# EAGLE board Large ground pour test (EAGLE 8.7.0)
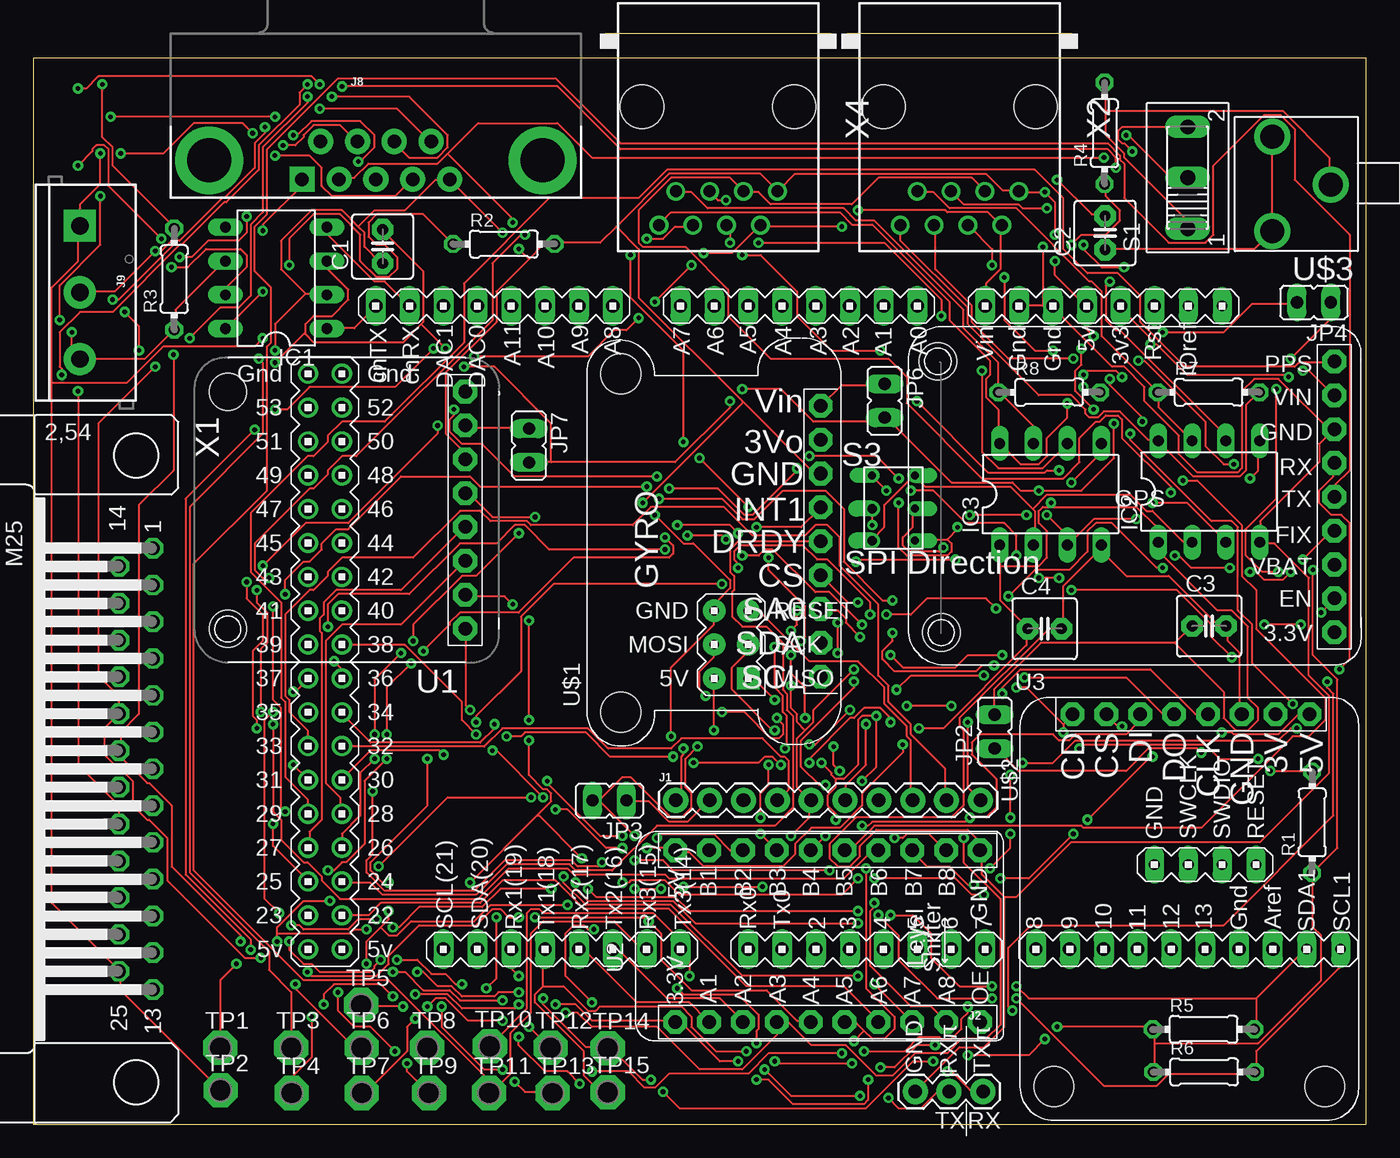
[diagram p1: board, top side]
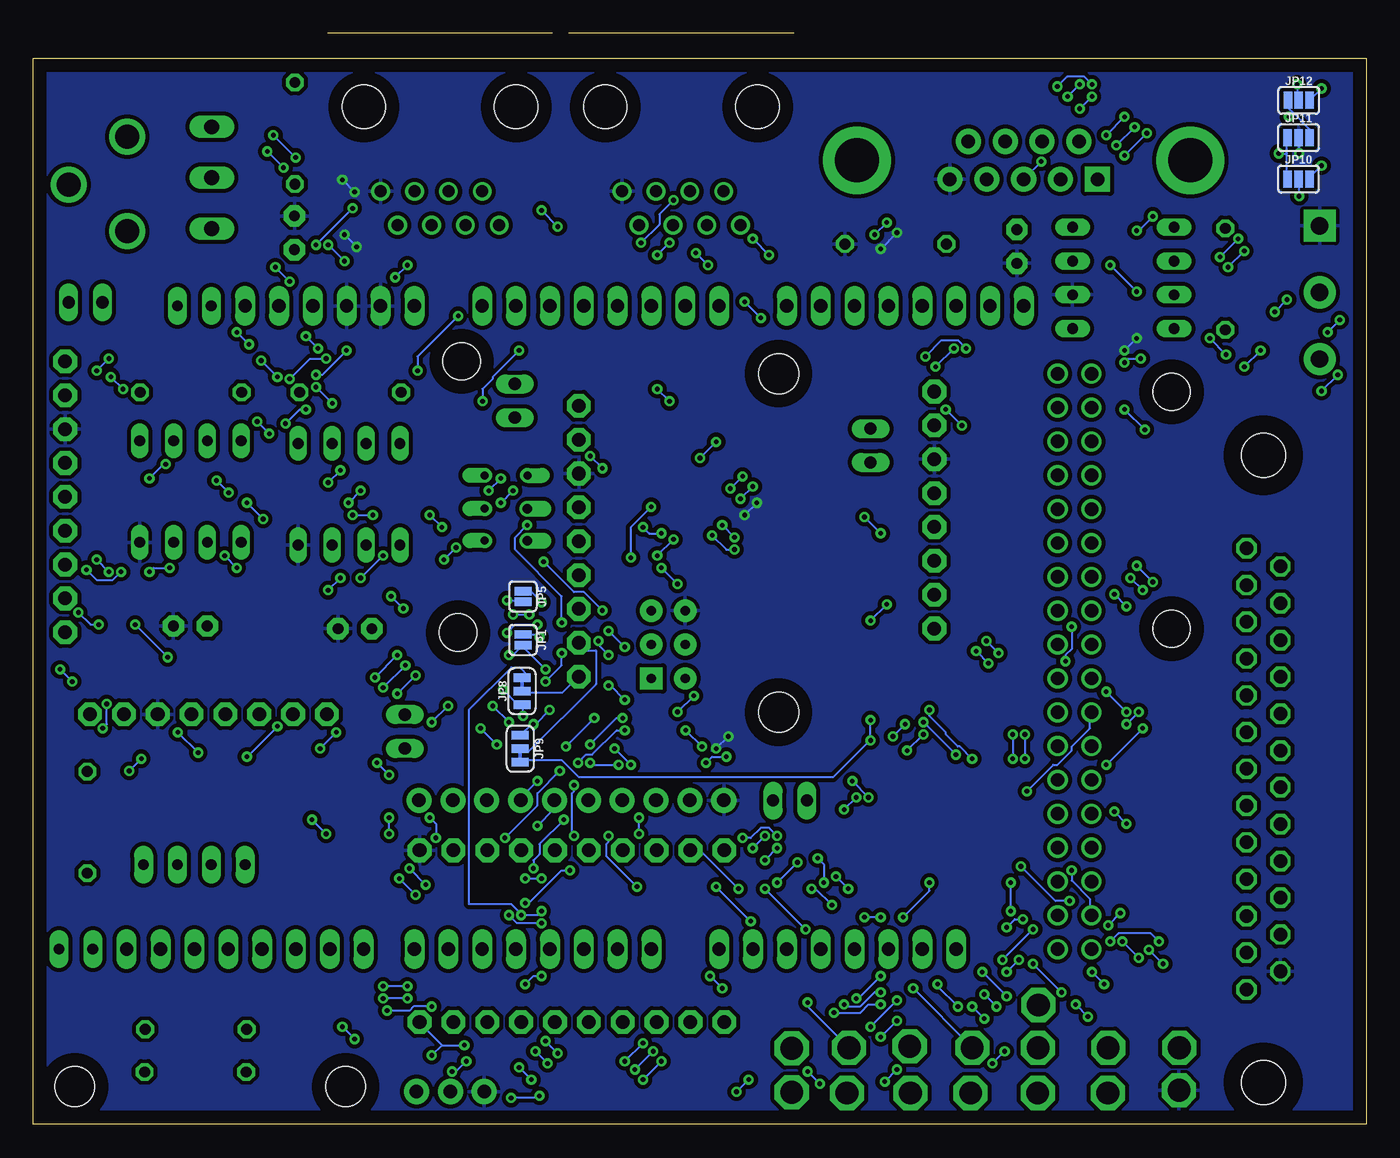
[diagram p2: board, bottom side, seen from below]

Size 100 x 80 mm. Coordinates in mm from the lower left corner, seen from the top.
Outline: 0,0 100,0 100,80 0,80 0,0
Copper layers (1*16): Top 0.035mm / dielectric 1.5mm / Bottom 0.035mm
Design rules "default": minimum track width 6mil, minimum drill 0.35mm, track to track 6mil, track to pad 6mil, pad to pad 6mil, via to via 6mil, smd to smd 6mil, copper to edge 40mil, drill to drill 6mil, minimum pad ring 10mil, minimum via ring 8mil, stop-mask expansion 4mil, vias tented up to drill 0mil, thermal gap 10mil
Net classes: 1 Power: width 0.508 mm, drill 0.305 mm, clearance 0.254 mm

## Footprints (pad centres in the part's own frame; a part is rotated, then mirrored left to right if it is on the bottom)
C2.5-5 = drill 0.813 pad 1.6 octagon: 1 -1.27,0; 2 1.27,0
DIL08 = drill 0.813 long: 1 -3.81,-3.81; 2 -1.27,-3.81; 3 1.27,-3.81; 4 3.81,-3.81; 5 3.81,3.81; 6 1.27,3.81; 7 -1.27,3.81; 8 -3.81,3.81
1X10 = drill 1.016 pad 1.88: 1 0,0; 2 2.54,0; 3 5.08,0; 4 7.62,0; 5 10.16,0; 6 12.7,0; 7 15.24,0; 8 17.78,0; 9 20.32,0; 10 22.86,0
1X03 = drill 1.016 pad 1.88: 1 2.54,0; 2 0,0; 3 -2.54,0
DB9_MALE = drill 1.016 pad 1.88: 1 5.54,-1.42; 2 2.77,-1.42; 3 0,-1.42; 4 -2.77,-1.42; 6 4.15,1.42; 7 1.38,1.42; 8 -1.38,1.42; 9 -4.15,1.42 | drill 1.016 pad 1.88 square: 5 -5.54,-1.42 | drill 3.302 pad 5.08: G1 -12.5,0; G2 12.5,0
SCREWTERMINAL-5MM-3 = drill 1.3 pad 2.413 square: 1 0,0 | drill 1.3 pad 2.413: 2 5,0; 3 10,0
SMT-JUMPER_2_NO_SILK = smd 0.635 x 1.27: 1 -0.406,0; 2 0.406,0
JP1 = drill 0.914 long: 1 0,-1.27; 2 0,1.27
SMT-JUMPER_3_1-NC_TRACE_SILK = smd 0.635 x 1.27: 1 -1.016,0; 2 0,0; 3 1.016,0
SMT-JUMPER_3_NO_SILK = smd 0.635 x 1.27: 1 -0.813,0; 2 0,0; 3 0.813,0
DUE(NORMAL) = drill 1 long: 2 -16.51,30.48; 3 -19.05,30.48; 3V3 -39.37,-17.78; 4 -21.59,30.48; 5 -24.13,30.48; 5V -36.83,-17.78; 6 -26.67,30.48; 7 -29.21,30.48; 8 -33.02,30.48; 9 -35.56,30.48; 10 -38.1,30.48; 11 -40.64,30.48; 12 -43.18,30.48; 13 -45.72,30.48; A0 -24.13,-17.78; A1 -21.59,-17.78; A2 -19.05,-17.78; A3 -16.51,-17.78; A4 -13.97,-17.78; A5 -11.43,-17.78; A6 -8.89,-17.78; A7 -6.35,-17.78; A8 -1.27,-17.78; A9 1.27,-17.78; A10 3.81,-17.78; A11 6.35,-17.78; AREF -50.8,30.48; CANRX 13.97,-17.78; CANTX 16.51,-17.78; DAC0 8.89,-17.78; DAC1 11.43,-17.78; GND1 -48.26,30.48; GND_1 -34.29,-17.78; GND_2 -31.75,-17.78; RESET -41.91,-17.78; RX0 -11.43,30.48; RX1 6.35,30.48; RX2 1.27,30.48; RX3 -3.81,30.48; SCL 11.43,30.48; SDA 8.89,30.48; TX0 -13.97,30.48; TX1 3.81,30.48; TX2 -1.27,30.48; TX3 -6.35,30.48; VIN -29.21,-17.78 | drill 1: 5V_A 19.05,30.48; 5V_B 21.59,30.48; 22 19.05,27.94; 23 21.59,27.94; 24 19.05,25.4; 25 21.59,25.4; 26 19.05,22.86; 27 21.59,22.86; 28 19.05,20.32; 29 21.59,20.32; 30 19.05,17.78; 31 21.59,17.78; 32 19.05,15.24; 33 21.59,15.24; 34 19.05,12.7; 35 21.59,12.7; 36 19.05,10.16; 37 21.59,10.16; 38 19.05,7.62; 39 21.59,7.62; 40 19.05,5.08; 41 21.59,5.08; 42 19.05,2.54; 43 21.59,2.54; 44 19.05,0; 45 21.59,0; 46 19.05,-2.54; 47 21.59,-2.54; 48 19.05,-5.08; 49 21.59,-5.08; 50 19.05,-7.62; 51 21.59,-7.62; 52 19.05,-10.16; 53 21.59,-10.16; GND_A 19.05,-12.7; GND_B 21.59,-12.7 | drill 0.7 pad 1.676: 5V_ICSP -8.89,5.08; GND_ICSP -8.89,10.16; MOSI_ICSP -8.89,7.62; RESET_ICSP -11.43,5.08; SCK_ICSP -11.43,7.62 | drill 0.8 pad 1.422 long: GND_DEBUG -41.91,24.13; IOREF -44.45,-17.78; NC -46.99,-17.78; RESET_DEBUG -49.53,24.13; SCL1 -55.88,30.48; SDA1 -53.34,30.48; SWCLK_DEBUG -44.45,24.13; SWDIO_DEBUG -46.99,24.13 | drill 0.7 pad 1.676 square: MISO_ICSP -11.43,10.16
0204/7 = drill 0.813 octagon: 1 -3.81,0; 2 3.81,0
255SB = drill 1.118 long: 1 -3.81,0; 2 0,0; 3 3.81,0
DPDT = drill 0.6 offset: 1 3.2,4.9; 2 3.2,2.4; 3 3.2,0; 4 0,4.9 | drill 0.7 offset: 5 0,2.4; 6 0,0
P1-17 = drill 1.702 pad 2.54 octagon: TP 0,0
ELCOMPASS = drill 1.016 pad 1.778 octagon: 1 1.27,1.27; 2 1.27,3.81; 3 1.27,6.35; 4 1.27,8.89; 5 1.27,11.43; 6 1.27,13.97; 7 1.27,16.51; 8 1.27,19.05 | hole 2.8: 19.066,19.07; 19.066,1.29
ELSHIFTER = drill 1.016 pad 1.778 octagon: 1 0,11.43; 2 0,8.89; 3 0,6.35; 4 0,3.81; 5 0,1.27; 6 0,-1.27; 7 0,-3.81; 8 0,-6.35; 9 0,-8.89; 10 0,-11.43; 11 12.89,11.43; 12 12.89,8.89; 13 12.89,6.35; 14 12.89,3.81; 15 12.89,1.27; 16 12.89,-1.27; 17 12.89,-3.81; 18 12.89,-6.35; 19 12.89,-8.89; 20 12.89,-11.43
ELGPS = drill 1.016 pad 1.778 octagon: 1 0,-10.16; 2 0,-7.62; 3 0,-5.08; 4 0,-2.54; 5 0,0; 6 0,2.54; 7 0,5.08; 8 0,7.62; 9 0,10.16 | hole 2.8: 29.48,10.18; 29.74,-10.18
ELGYRO = drill 1.016 pad 1.778 octagon: 1 21.59,2.54; 2 19.05,2.54; 3 16.51,2.54; 4 13.97,2.54; 5 11.43,2.54; 6 8.89,2.54; 7 6.35,2.54; 8 3.81,2.54; 9 1.27,2.54 | hole 3: -1.397,17.526; 24.003,17.526
ELSDCARD = drill 1.016 pad 1.778 octagon: 1 1.27,1.27; 2 1.27,3.81; 3 1.27,6.35; 4 1.27,8.89; 5 1.27,11.43; 6 1.27,13.97; 7 1.27,16.51; 8 1.27,19.05 | hole 3: -26.67,0.127; -26.67,20.447
2.5MMJACK = drill 1.8: 1 2,5.1; 2 6.4,1.5; 3 6.4,8.6
M25H = drill 1.016 octagon: 1 -16.561,1.27; 2 -13.792,1.27; 3 -11.049,1.27; 4 -8.28,1.27; 5 -5.512,1.27; 6 -2.769,1.27; 7 0,1.27; 8 2.769,1.27; 9 5.512,1.27; 10 8.28,1.27; 11 11.049,1.27; 12 13.792,1.27; 13 16.561,1.27; 14 -15.189,-1.27; 15 -12.421,-1.27; 16 -9.652,-1.27; 17 -6.909,-1.27; 18 -4.14,-1.27; 19 -1.372,-1.27; 20 1.372,-1.27; 21 4.14,-1.27; 22 6.909,-1.27; 23 9.652,-1.27; 24 12.421,-1.27; 25 15.189,-1.27 | hole 3.302: 23.52,0; -23.52,0
RJ45-NO-SHIELD = drill 0.9 pad 1.4: 1 -4.445,6.35; 2 -3.175,8.89; 3 -1.905,6.35; 4 -0.635,8.89; 5 0.635,6.35; 6 1.905,8.89; 7 3.175,6.35; 8 4.445,8.89 | hole 3.251: -5.715,0; 5.715,0

## Placement (x,y rotation side)
C1  0.1 uF  [C2.5-5]  26.21,65.87 90 top
C2  1 uF  [C2.5-5]  80.41,66.89 90 top
C3  0.1 uF  [C2.5-5]  88.22,37.39 0 top
C4  0.1 uF  [C2.5-5]  75.87,37.19 0 top
IC1  MCP2551  [DIL08]  18.22,63.51 90 top
IC2  DS8921  [DIL08]  88.21,47.48 0 top
IC3  DS8921  [DIL08]  76.31,47.28 0 top
J1  Optical Mouse  [1X10]  48.2,24.32 0 top
J2  RaspπUart  [1X03]  68.71,2.46 0 top
J8  DB9 Plug  [DB9_MALE]  25.7,72.33 0 top
J9  CAN Output  [SCREWTERMINAL-5MM-3]  3.49,67.42 270 top
JP1  [SMT-JUMPER_2_NO_SILK]  63.27,36.35 270 bottom
JP2  MicroSD Power  [JP1]  72.12,29.47 0 top
JP3  Mouse Power  [JP1]  43.23,24.3 90 top
JP4  GPS Power  [JP1]  96.08,61.67 90 top
JP5  [SMT-JUMPER_2_NO_SILK]  63.27,39.61 270 bottom
JP6  Gyro Power  [JP1]  63.88,54.29 180 top
JP7  Compass Power  [JP1]  37.19,50.93 180 top
JP8  [SMT-JUMPER_3_1-NC_TRACE_SILK]  63.33,32.5 90 bottom
JP9  [SMT-JUMPER_3_1-NC_TRACE_SILK]  63.47,28.19 270 bottom
JP10  [SMT-JUMPER_3_NO_SILK]  5.08,70.93 0 bottom
JP11  [SMT-JUMPER_3_NO_SILK]  5.07,74.03 0 bottom
JP12  [SMT-JUMPER_3_NO_SILK]  5.06,76.83 0 bottom
MCU2  DUE(NORMAL)  [DUE(NORMAL)]  42.2,43.62 180 top
R1  4.7 k  [0204/7]  95.95,22.66 90 top
R2  10 k  [0204/7]  35.3,66.05 0 top
R3  120  [0204/7]  10.57,63.42 90 top
R4  4.7 k  [0204/7]  80.37,74.36 90 top
R5  4.7 k  [0204/7]  87.8,7.13 0 top
R6  4.7 k  [0204/7]  87.84,3.93 0 top
R7  100  [0204/7]  88.18,54.93 0 top
R8  100  [0204/7]  76.22,54.93 0 top
S1  Click Source  [255SB]  86.61,71.03 90 top
S3  SPI Direction  [DPDT]  62.93,43.79 0 top
TP1  TPPAD1-17  [P1-17]  14.02,5.75 0 top
TP2  TPPAD1-17  [P1-17]  14.04,2.55 0 top
TP3  TPPAD1-17  [P1-17]  19.36,5.75 0 top
TP4  TPPAD1-17  [P1-17]  19.38,2.35 0 top
TP5  TPPAD1-17  [P1-17]  24.6,8.95 0 top
TP6  TPPAD1-17  [P1-17]  24.62,5.75 0 top
TP7  TPPAD1-17  [P1-17]  24.64,2.35 0 top
TP8  TPPAD1-17  [P1-17]  29.56,5.75 0 top
TP9  TPPAD1-17  [P1-17]  29.68,2.35 0 top
TP10  TPPAD1-17  [P1-17]  34.25,5.85 0 top
TP11  TPPAD1-17  [P1-17]  34.2,2.35 0 top
TP12  TPPAD1-17  [P1-17]  38.8,5.75 0 top
TP13  TPPAD1-17  [P1-17]  38.95,2.35 0 top
TP14  TPPAD1-17  [P1-17]  43.1,5.7 0 top
TP15  TPPAD1-17  [P1-17]  43.1,2.4 0 top
U1  COMPASS  [ELCOMPASS]  33.67,56.25 180 top
U2  LLSHIFTER  [ELSHIFTER]  59.59,7.67 90 top
U3  GPS  [ELGPS]  97.61,47.08 180 top
U$1  Gyro  [ELGYRO]  61.61,32.32 90 top
U$2  Micro-SD  [ELSDCARD]  97.02,29.5 90 top
U$3  [2.5MMJACK]  99.36,75.6 180 top
X1  Vehicle control  [M25H]  7.71,26.67 270 top
X2  RJ45-8L-B  [RJ45-NO-SHIELD]  69.49,76.35 180 top
X4  RJ45-8L-B  [RJ45-NO-SHIELD]  51.38,76.35 180 top

## Tracks (layer width: path | path; a pad name or v marks a point on that pad's centre or on a via)
+3V3  (via drill 0.35)
  Top 0.152: v52.88,4.72 51.51,4.72 48.62,7.62 48.31,7.62 U2.1 48.16,7.77 41.91,7.77 40.69,8.99 v39.17,8.99 | v54.25,3.35 55.17,3.35 57,1.52 62.33,1.52 62.64,1.83 v62.64,3.35 | v63.55,4.27 64.62,4.27 66.29,5.94 v67.67,5.94 | v20.88,8.08 20.88,5.03 19.51,3.66 19.51,2.44 TP4.TP | v21.79,8.99 21.79,9.75 22.55,10.52 26.06,10.52 v26.98,9.6 | v28.8,11.43 29.26,11.43 30.33,10.36 31.39,10.36 32.16,9.6 34.59,9.6 34.9,9.91 v36.42,9.91 | v84.73,59.44 89.31,59.44 91.44,61.57 94.79,61.57 JP4.2 | MCU2.3V3 81.53,61.27 83.82,58.98 v83.82,58.52 84.28,58.52 86.56,56.24 94.03,56.24 v94.18,56.08 | 84.12,6.1 84.12,7.01 R5.1 83.97,7.16 83.82,7.32 v76.81,7.32 | 84.12,6.1 84.12,3.96 R6.1 | 84.12,6.1 91.9,6.1 96.62,10.82 96.62,14.17 96.01,14.78 96.01,18.75 R1.1 96.01,18.9 97.84,20.73 97.84,33.38 96.01,35.2 v96.01,41.6 | v93.27,55.17 93.27,46.94 90.98,44.65 90.98,42.67 92.2,41.45 v93.42,41.45 | v70.1,5.18 74.68,5.18 v75.89,6.4
  Bottom 0.152: v54.25,3.35 v52.88,4.72 | v63.55,4.27 v62.64,3.35 | 69.34,5.94 v67.67,5.94 | 69.34,5.94 71.02,7.62 U2.10 | v21.79,8.99 v20.88,8.08 | v28.8,11.43 v26.98,9.6 | v36.42,9.91 36.88,9.91 37.95,8.84 39.01,8.84 v39.17,8.99 | v83.82,58.52 v84.73,59.44 | v93.27,55.17 v94.18,56.08 | v93.42,41.45 94.03,40.84 95.25,40.84 v96.01,41.6 | v70.1,5.18 69.34,5.94 | v76.81,7.32 v75.89,6.4
+5V  (via drill 0.35)
  Top 0.152: 20.42,59.44 20.42,59.28 21.03,58.67 27.74,58.67 29.11,60.05 | 20.42,59.44 20.42,60.05 21.03,60.66 22.4,60.66 23.62,61.87 23.62,62.64 22.1,64.16 22.1,64.77 IC1.3 | 29.11,60.05 29.26,60.2 29.26,64.01 26.21,67.06 C1.2 | v16.92,57.45 17.22,57.15 17.22,51.82 11.73,46.33 11.73,18.9 17.68,12.95 17.68,11.58 19.36,9.91 19.36,5.79 TP3.TP | 20.42,59.44 v18.14,57.15 | v77.88,65.99 78.64,66.75 80.47,66.75 81.53,67.82 81.53,68.58 80.47,69.65 80.47,70.41 R4.1 | v76.66,64.77 76.66,63.7 78.94,61.42 MCU2.5V 79.1,61.27 79.1,59.59 v79.55,59.13 | 38.86,49.68 48.16,49.68 52.27,53.8 v52.27,54.25 | 38.86,49.68 37.34,49.68 JP7.2 | v53.19,55.17 56.08,55.17 58.52,52.73 63.7,52.73 63.86,52.88 JP6.2 64.01,53.03 68.89,48.16 73.46,48.16 74.07,47.55 v75.44,47.55 78.64,47.55 81.08,49.99 v81.08,52.58 | v78.64,58.22 78.64,57 78.18,56.54 78.18,55.02 v79.55,53.65 | 42.37,24.23 42.52,24.23 v45.11,21.64 | 42.37,24.23 42.06,24.23 JP3.2 42.37,24.23 | v46.02,20.73 48.01,20.73 48.16,20.57 U2.11 48.31,20.42 49.23,20.42 50.29,19.36 56.24,19.36 57.15,20.27 57.15,21.03 58.37,22.25 60.5,22.25 62.18,23.93 62.18,24.84 65.23,27.89 v65.23,28.5 | v51.05,29.57 51.05,33.38 MCU2.GND_ICSP | v49.84,28.35 48.92,27.43 48.92,25.3 49.38,24.84 49.38,23.77 48.62,23.01 47.85,23.01 44.81,26.06 44.2,26.06 42.37,24.23 | 72.54,41.91 72.54,39.32 74.52,37.34 C4.1 74.52,37.19 74.52,35.97 68.28,29.72 v66.45,29.72 | 72.54,41.91 72.54,43.43 IC3.1 | 76.35,46.33 75.74,46.33 75.44,46.02 75.44,45.11 76.05,44.5 76.05,42.52 75.44,41.91 72.54,41.91 | 76.35,46.33 82.75,46.33 84.28,44.81 84.28,43.74 IC2.1 84.43,43.59 84.43,42.98 88.85,38.56 89.92,38.56 91.14,37.34 91.14,32 91.9,31.24 91.9,30.33 91.14,29.57 90.22,29.57 89.31,30.48 89.31,32.46 85.65,36.12
  Top 0.152: 85.65,36.12 75.59,36.12 72.08,32.61 72.08,30.79 JP2.2 | 85.65,36.12 86.87,37.34 C3.1 | 76.35,46.33 v76.35,46.63 | v30.94,58.22 29.11,60.05 | v32.31,56.84 34.59,56.84 38.86,52.58 38.86,49.68
  Bottom 0.152: v16.92,57.45 17.83,57.45 v18.14,57.15 | v76.66,64.77 v77.88,65.99 | v53.19,55.17 v52.27,54.25 | v78.64,58.22 v79.55,59.13 | v79.55,53.65 80.01,53.65 v81.08,52.58 | v46.02,20.73 v45.11,21.64 | v49.84,28.35 v51.05,29.57 | v66.45,29.72 v65.23,28.5 | v76.35,46.63 v75.44,47.55 | v32.31,56.84 v30.94,58.22
C2_RX  (via drill 0.35)
  Top 0.152: v9.14,56.84 4.88,52.58 4.88,33.68 6.4,32.16 6.4,30.94 X1.18 6.4,30.79 5.33,29.72 5.33,27.74 6.1,26.98 6.25,26.98 7.47,25.76 7.47,23.93 8.53,22.86 8.69,22.86 10.06,21.49 10.06,18.29 15.85,12.5 v17.07,12.5 | v7.92,58.06 7.92,59.89 v6.86,60.96 | v5.94,61.87 6.4,61.87 10.82,66.29 10.97,66.29 14.17,69.49 14.33,69.49 16.61,71.78 16.61,73.61 17.37,74.37 v17.37,74.83 | v18.75,73.46 19.66,73.46 20.27,74.07 20.27,74.22 21.03,74.98 23.01,74.98 24.23,73.76 J8.8 | v46.79,21.49 47.09,21.79 51.05,21.79 52.27,20.57 53.19,20.57 U2.13 | v44.2,21.64 42.52,21.64 38.56,25.6 v38.56,25.76 | v37.34,24.54 31.09,24.54 v25.91,19.36 | v22.25,16.76 20.27,16.76 18.29,14.78 18.29,14.33 | v18.29,13.72 18.29,14.33 | v36.12,3.2 36.88,2.44 38.86,2.44 TP13.TP | v35.2,4.12 33.83,4.12 30.63,7.32 v30.63,8.84 | v32.16,10.52 31.7,10.52 30.94,11.28 29.87,11.28 28.8,12.34 v27.28,12.34 | v24.99,14.63 24.08,14.63 23.77,14.33 18.29,14.33
  Bottom 0.152: v7.92,58.06 v9.14,56.84 | v5.94,61.87 v6.86,60.96 | v18.75,73.46 v17.37,74.83 | v46.79,21.49 46.18,21.49 45.41,22.25 44.81,22.25 v44.2,21.64 | v37.34,24.54 v38.56,25.76 | v25.91,19.36 23.32,16.76 v22.25,16.76 | v17.07,12.5 v18.29,13.72 | v35.2,4.12 v36.12,3.2 | v30.63,8.84 32.16,10.36 v32.16,10.52 | v24.99,14.63 v27.28,12.34
C2_TX  (via drill 0.35)
  Top 0.152: v45.11,17.68 v47.09,17.68 | v42.06,14.63 41.6,14.63 41.3,14.94 40.54,14.94 39.93,14.33 39.93,11.12 v41.91,9.14 | 6.55,28.04 6.55,29.41 7.92,30.79 7.92,46.48 10.52,49.07 v10.52,57.76 | v11.73,58.98 14.02,61.27 15.39,61.27 16.31,62.18 16.31,67.51 17.22,68.43 17.22,73.3 20.57,76.66 v20.57,77.11 | v21.49,76.2 27.28,76.2 29.72,73.76 J8.6 | v37.19,7.32 38.71,5.79 TP12.TP | v35.2,9.3 32,9.3 31.24,10.06 29.26,10.06 27.89,11.43 v26.98,11.43 | v26.06,12.34 25.6,11.89 25.6,11.73 25.3,11.43 21.49,11.43 20.88,12.04 20.27,12.04 19.2,13.11 v19.2,13.72 | v15.54,13.72 15.54,14.17 10.36,19.36 10.36,23.93 8.69,25.6 8.53,25.6 6.55,27.58 6.55,28.04 | 6.55,28.04 X1.19
  Bottom 0.152: v47.09,17.68 49.84,20.42 50.6,20.42 U2.12 | v42.06,14.63 v45.11,17.68 | v41.91,9.14 41.91,8.84 38.86,5.79 TP12.TP | v11.73,58.98 v10.52,57.76 | v21.49,76.2 v20.57,77.11 | v35.2,9.3 v37.19,7.32 | v26.06,12.34 v26.98,11.43 | v19.2,13.72 18.59,14.33 16.15,14.33 v15.54,13.72
CANH  (via drill 0.35)
  Top 0.152: v5.18,78.03 5.18,74.07 5.94,73.3 5.94,71.93 10.52,67.36 R3.2 10.52,67.21 10.52,66.45 9.6,65.53 v9.14,65.53 6.1,62.48 3.5,62.48 J9.2 | v10.36,64.31 11.58,64.31 12.95,65.68 15.54,65.68 16,65.23 16,64.31 14.48,62.79 14.48,62.33 IC1.7
  Bottom 0.152: v5.18,78.03 5.18,76.96 JP12.2 | v9.14,65.53 v10.36,64.31
CANL  (via drill 0.35)
  Top 0.152: IC1.6 14.33,64.77 10.67,61.11 10.67,59.74 R3.1 10.52,59.59 8.38,57.45 3.5,57.45 J9.3 3.35,57.45 2.9,57.91 v2.9,59.44 | v5.03,69.65 5.03,65.99 1.98,62.94 v1.98,60.35
  Bottom 0.152: v5.03,69.65 5.03,70.87 JP10.2 | v2.9,59.44 v1.98,60.35
CANRX
  Top 0.152: IC1.4 22.1,67.21 22.1,66.75 25.6,63.25 26.36,63.25 28.19,61.42 MCU2.CANRX
CANTX
  Top 0.152: IC1.1 22.1,59.74 24.08,59.74 25.6,61.27 MCU2.CANTX
CARD_DETECT  (via drill 0.35)
  Top 0.152: v92.81,26.52 95.86,26.52 R1.2 | v91.9,27.43 89,27.43 87.94,28.5 78.79,28.5 v78.49,28.19 | 77.27,30.02 v77.27,29.41 | 77.27,30.02 77.88,30.63 U$2.8 | v22.55,34.75 23.01,34.29 23.01,33.53 MCU2.36 | v22.1,37.34 22.1,39.01 22.86,39.78 28.19,39.78 32,43.59 34.75,43.59 36.12,44.96 36.88,44.96 38.71,43.13 v47.4,43.13 | v49.07,44.2 51.66,44.2 v51.97,43.89 | v53.19,42.67 54.41,42.67 54.86,43.13 55.47,43.13 58.67,39.93 59.74,39.93 v62.18,37.49 | v64.47,36.88 64.47,36.27 63.7,35.51 63.7,34.9 64.62,33.98 70.71,33.98 71.17,34.44 v72.08,34.44 | v73.76,32.77 74.52,32.77 77.27,30.02
  Bottom 0.152: v91.9,27.43 v92.81,26.52 | v77.27,29.41 v78.49,28.19 | v22.55,34.75 22.55,35.2 22.1,35.66 v22.1,37.34 | v47.4,43.13 48.01,43.13 v49.07,44.2 | v53.19,42.67 v51.97,43.89 | v62.18,37.49 63.86,37.49 v64.47,36.88 | v73.76,32.77 v72.08,34.44
CLICK  (via drill 0.35)
  Top 0.152: v81.99,74.22 82.14,74.22 85.19,71.17 86.56,71.17 S1.2 | v80.31,72.54 41.91,72.54 39.32,75.13 33.38,75.13 31.09,72.85 | 31.09,72.85 30.33,72.08 25.15,72.08 24.08,71.02 23.01,71.02 J8.4 | v17.98,30.02 17.98,23.47 18.59,22.86 18.59,21.34 20.27,19.66 20.57,19.66 21.64,18.59 21.64,18.29 23.01,16.92 33.38,16.92 35.66,19.2 40.08,19.2 40.54,18.75 47.4,18.75 47.7,18.44 60.81,18.44 62.79,20.42 63.4,20.42 U2.17 | v17.07,30.94 17.07,35.66 17.53,36.12 17.53,38.41 16.76,39.17 v16.76,40.08 | v17.68,41 17.22,41 16.61,41.6 16.61,43.59 20.73,47.7 21.03,47.7 22.1,48.77 22.1,49.07 23.16,50.14 24.23,50.14 34.44,60.35 34.44,64.62 36.58,66.75 v36.88,66.75 | v35.97,67.67 35.97,67.97 31.09,72.85
  Bottom 0.152: v80.31,72.54 v81.99,74.22 | v17.07,30.94 v17.98,30.02 | v17.68,41 v16.76,40.08 | v35.97,67.67 v36.88,66.75
CS_C5_FRONT  (via drill 0.35)
  Top 0.152: v19.51,32.46 19.66,32.46 20.57,33.38 MCU2.37 | v17.98,30.94 17.37,30.33 17.37,16.92 v18.44,15.85 | v19.36,14.94 19.96,14.94 20.27,14.63 23.62,14.63 24.38,15.39 v25.76,15.39 | v26.98,14.78 27.43,14.78 28.96,16.31 33.68,16.31 35.05,17.68 v38.86,17.68 | v39.78,18.59 39.78,18.14 41.45,16.46 47.85,16.46 53.19,11.12 v61.87,11.12 | v63.09,10.52 65.84,7.77 U2.8
  Bottom 0.152: v17.98,30.94 v19.51,32.46 | v19.36,14.94 v18.44,15.85 | v25.76,15.39 26.36,15.39 v26.98,14.78 | v39.78,18.59 v38.86,17.68 | v61.87,11.12 62.48,11.12 v63.09,10.52
CS_C5_FRONT_5V  (via drill 0.35)
  Top 0.152: v78.03,57.45 73.15,57.45 70.41,60.2 70.41,61.42 67.67,64.16 67.67,67.36 X2.6 | v80.77,55.93 80.77,55.47 83.21,53.03 v83.21,52.73 | v82.3,51.82 82.3,51.36 88.39,45.26 89.92,45.26 90.37,44.81 90.37,38.56 91.44,37.49 91.44,34.59 v94.49,31.55 | v94.79,29.72 94.34,29.72 93.42,28.8 78.18,28.8 76.5,27.13 v74.22,27.13 | v73.3,23.01 v73.3,26.21 | v73.3,21.79 73.3,20.73 v71.78,19.2 | v70.56,17.98 70.1,17.98 68.73,19.36 67.06,19.36 65.99,20.42 U2.18
  Bottom 0.152: v78.03,57.45 79.25,57.45 v80.77,55.93 | v82.3,51.82 v83.21,52.73 | v94.49,31.55 94.49,30.02 v94.79,29.72 | v73.3,26.21 v74.22,27.13 | v73.3,21.79 v73.3,23.01 | v70.56,17.98 v71.78,19.2
CS_C5_REAR  (via drill 0.35)
  Top 0.152: v33.22,29.26 32.16,30.33 32.16,31.7 27.89,35.97 23.16,35.97 MCU2.38 | v34.44,28.04 34.75,28.04 v38.25,24.54 | v39.17,23.62 40.08,23.62 42.98,20.73 v44.2,20.73 | v45.11,19.81 47.24,19.81 48.01,19.05 v59.74,19.05 | v63.09,16.61 63.09,16.31 62.79,16 62.79,11.89 65.84,8.84 67.36,8.84 68.43,7.77 U2.9
  Bottom 0.152: v34.44,28.04 v33.22,29.26 | v39.17,23.62 v38.25,24.54 | v45.11,19.81 v44.2,20.73 | v59.74,19.05 60.35,19.05 62.79,16.61 v63.09,16.61
CS_C5_REAR_5V  (via drill 0.35)
  Top 0.152: v46.02,66.45 47.24,66.45 48.16,67.36 49.38,67.36 X4.6 | v44.81,65.23 44.81,62.03 48.77,58.06 v48.77,51.21 | v53.65,46.33 v49.99,49.99 | v55.17,42.52 55.17,41.6 57.91,38.86 57.91,36.58 v57.61,36.27 | v56.84,35.2 56.84,33.83 57.91,32.77 v57.91,30.48 | v60.05,28.35 60.05,26.98 v60.5,26.52 | v64.62,21.49 65.23,21.49 65.53,21.79 67.21,21.79 68.43,20.57 U2.19
  Bottom 0.152: v44.81,65.23 v46.02,66.45 | v49.99,49.99 v48.77,51.21 | v53.65,46.33 55.17,44.81 v55.17,42.52 | v57.61,36.27 57.61,35.97 v56.84,35.2 | v60.05,28.35 v57.91,30.48 | v60.5,26.52 62.18,24.84 62.18,23.93 v64.62,21.49
CS_GYRO  (via drill 0.35)
  Top 0.152: v64.47,39.32 63.7,39.32 60.81,42.22 60.81,46.18 59.44,47.55 56.24,47.55 54.1,45.41 53.19,45.41 51.66,46.94 v46.94,46.94 | v46.02,47.85 33.53,47.85 32.77,48.62 27.58,48.62 23.62,44.65 22.71,44.65 21.64,43.59 21.64,43.13 20.73,42.22 20.27,42.22 18.9,40.84 v18.9,39.78 | v17.98,38.86 17.98,31.85 18.59,31.24 18.59,23.77 v18.9,23.47 | v17.98,22.55 17.98,20.88 20.57,18.29 MCU2.25
  Bottom 0.152: v64.47,39.32 63.4,39.32 JP5.2 | v46.02,47.85 v46.94,46.94 | v17.98,38.86 v18.9,39.78 | v17.98,22.55 v18.9,23.47
CS_MOUSE
  Top 0.152: MCU2.32 23.16,28.35 33.83,28.35 35.2,29.72 41.6,29.72 43.13,28.19 47.85,28.19 48.62,28.96 54.71,28.96 56.08,27.58 56.39,27.58 56.69,27.28 56.69,25.15 55.93,24.38 J1.4
CS_SD  (via drill 0.35)
  Top 0.152: v25.45,24.99 25.45,20.27 24.99,19.81 24.99,18.9 26.36,17.53 33.07,17.53 35.36,19.81 40.39,19.81 40.84,19.36 42.37,19.36 v42.67,19.66 | v44.2,18.14 44.65,18.14 44.81,18.29 47.4,18.29 48.46,17.22 60.66,17.22 v61.87,18.44 | v63.09,18.44 69.19,18.44 70.41,17.22 v71.32,17.22 | v72.54,18.44 74.68,18.44 v78.03,21.79 | v79.1,22.86 83.82,27.58 v83.97,27.58 | v81.69,29.87 81.38,29.87 80.62,30.63 U$2.7
  Bottom 0.152: v25.45,24.99 23.47,26.98 23.16,26.98 22.1,28.04 22.1,28.35 20.73,29.72 20.73,30.79 MCU2.35 | v44.2,18.14 v42.67,19.66 | v63.09,18.44 v61.87,18.44 | v72.54,18.44 v71.32,17.22 | v79.1,22.86 v78.03,21.79 | v81.69,29.87 v83.97,27.58
DRDY_C  (via drill 0.35)
  Top 0.152: v25.6,27.43 24.54,26.36 24.54,23.16 23.16,21.79 23.16,20.88 MCU2.26 | v25.6,29.26 25.6,33.38 v27.58,35.36 | v28.5,36.27 28.5,37.49 32.16,41.15 33.22,41.15 v36.42,44.35 | v37.64,45.57 34.44,45.57 32.77,47.24 32.46,47.24 U1.4
  Bottom 0.152: v25.6,29.26 v25.6,27.43 | v28.5,36.27 v27.58,35.36 | v37.64,45.57 v36.42,44.35
DRDY_G
  Top 0.152: MCU2.24 23.16,18.14 25.3,18.14 26.21,17.22 33.22,17.22 35.51,19.51 40.23,19.51 40.69,19.05 43.43,19.05 46.79,22.4 55.63,22.4 57,23.77 57,30.63 56.54,31.09 56.54,32.31 56.24,32.61 56.24,36.12 55.02,37.34 53.19,37.34 52.43,38.1 52.43,39.93 52.58,40.08 52.58,41.15 52.27,41.45 52.27,43.13 52.88,43.74 58.98,43.74 U$1.5
EN  (via drill 0.35)
  Top 0.152: v19.51,26.98 20.57,25.91 MCU2.31 | v16.76,29.72 16.76,30.33 16.46,30.63 16.46,35.51 17.22,36.27 17.22,38.25 16,39.47 v16,40.69 | v17.22,41.91 20.42,45.11 23.62,45.11 30.33,51.82 v30.33,52.43 | v31.55,53.65 31.55,53.19 31.24,52.88 31.24,51.97 32.16,51.05 33.68,51.05 36.12,48.62 v46.79,48.62 | v47.7,47.7 51.36,47.7 53.34,45.72 53.95,45.72 57.3,49.07 v57.3,49.23 | v58.22,50.14 63.25,50.14 v64.92,48.46 | v65.84,47.55 67.51,47.55 69.95,45.11 72.85,45.11 73.76,44.2 v73.76,42.67 | v76.96,41 v75.44,41 | v77.88,40.08 85.8,40.08 88.39,37.49 88.39,36.58 v89.92,35.05 | v95.1,37.49 v92.35,37.49 | v96.62,38.41 97.54,39.32 U3.8
  Bottom 0.152: v16.76,29.72 v19.51,26.98 | v17.22,41.91 v16,40.69 | v31.55,53.65 v30.33,52.43 | v47.7,47.7 v46.79,48.62 | v58.22,50.14 v57.3,49.23 | v65.84,47.55 v64.92,48.46 | v75.44,41 v73.76,42.67 | v77.88,40.08 v76.96,41 | v92.35,37.49 v89.92,35.05 | v95.1,37.49 95.71,37.49 v96.62,38.41
FIX  (via drill 0.35)
  Top 0.152: v30.79,27.74 30.48,28.04 25.3,28.04 23.16,25.91 MCU2.30 | v33.22,30.18 33.22,30.63 36.58,33.98 36.58,38.1 39.01,40.54 v51.66,40.54 | v52.88,41.76 52.88,42.06 52.58,42.37 52.58,42.98 53.03,43.43 57.76,43.43 58.83,42.37 59.59,42.37 62.79,39.17 v62.79,38.25 | v64.01,38.25 65.84,38.25 67.06,39.47 71.48,39.47 v72.24,38.71 | v73.15,39.62 75.13,41.6 77.72,41.6 79.1,42.98 79.1,44.5 79.7,45.11 80.92,45.11 84.28,41.76 v84.73,41.76 | v85.65,42.67 85.95,42.67 86.87,41.76 v89.76,41.76 | v91.29,41.45 91.75,41.45 92.35,40.84 93.73,40.84 v94.34,41.45 | v95.25,42.37 97.54,44.65 U3.6
  Bottom 0.152: v33.22,30.18 v30.79,27.74 | v52.88,41.76 v51.66,40.54 | v64.01,38.25 v62.79,38.25 | v73.15,39.62 v72.24,38.71 | v85.65,42.67 v84.73,41.76 | v89.76,41.76 90.98,41.76 v91.29,41.45 | v95.25,42.37 v94.34,41.45
GND  (via drill 0.35)
  Top 0.152: 75.74,61.42 76.35,61.42 MCU2.GND_1 | 75.74,61.42 74.07,61.42 MCU2.GND_2 | 97.38,51.97 97.54,52.12 U3.3 97.38,51.97 | 97.38,51.97 96.47,51.05 96.47,49.68 92.05,45.26 92.05,43.74 IC2.4 92.05,43.59 93.12,43.59 95.71,41 95.71,33.68 97.23,32.16 97.23,26.36 92.05,21.18 77.88,21.18 73.76,17.07 72.85,17.07 | 97.38,51.97 93.42,55.93 91.59,55.93 90.68,55.02 90.68,49.23 90.37,48.92 87.33,48.92 85.95,50.29 85.95,51.66 83.36,54.25 83.36,55.32 81.84,56.84 80.92,56.84 76.5,61.27 MCU2.GND_1 | 72.85,17.07 71.17,18.75 71.17,20.42 U2.20 71.02,20.57 71.02,21.18 70.1,22.1 63.25,22.1 62.03,20.88 62.03,20.12 61.27,19.36 60.35,19.36 59.74,19.96 59.74,21.03 61.72,23.01 68.89,23.01 69.8,23.93 69.8,29.57 69.49,29.87 69.49,30.48 76.2,37.19 77.11,37.19 C4.2 77.27,37.34 77.27,40.39 80.01,43.13 | 72.85,17.07 72.85,7.32 71.32,5.79 69.49,5.79 66.29,2.59 J2.3 | U$2.3 90.53,30.79 90.53,35.36 89.61,36.27 89.61,37.34 C3.2 89.46,37.49 88.85,37.49 85.19,41.15 81.99,41.15 80.01,43.13 | 80.01,43.13 80.01,43.43 IC3.4 80.01,43.13 | v5.03,72.85 5.03,70.56 3.5,69.04 3.5,67.51 J9.1 3.35,67.36 3.35,64.77 1.37,62.79 1.37,55.63 | TP2.TP 14.02,2.59 6.55,10.06 6.55,11.43 X1.25 6.4,11.58 1.37,16.61 1.37,55.63 | 20.42,62.33 21.95,62.33 IC1.2 | 20.42,62.33 18.59,64.16 18.59,66.29 20.88,68.58 23.16,68.58 24.38,67.36 | 24.38,67.36 24.84,66.9 24.84,65.84 26.06,64.62 C1.1 | 24.38,67.36 25.6,68.58 27.89,68.58 30.18,70.87 31.09,70.87 J8.1 31.24,70.87 v35.2,66.9 | v47.85,29.11 47.85,34.29 51.05,37.49 51.05,38.41 MCU2.5V_ICSP 51.21,38.56 51.21,39.17 52.27,40.23 52.27,40.84 49.53,43.59 48.77,43.59 v46.63,45.72
  Top 0.152: v48.77,28.19 48.77,27.74 48.62,27.58 48.62,24.69 48.31,24.38 J1.1 | 43.74,67.36 47.7,71.32 54.56,71.32 55.78,70.1 X4.1 55.93,70.1 57.15,71.32 71.48,71.32 72.69,70.1 73.91,70.1 X2.1 74.07,69.95 v75.89,69.95 76.66,69.19 v76.66,66.75 | 43.74,67.36 42.52,66.14 39.17,66.14 R2.2 39.01,65.99 38.25,65.99 37.19,64.92 | v76.81,70.87 79.4,68.28 80.31,68.28 C2.2 | 53.19,54.25 45.41,62.03 45.41,65.68 43.74,67.36 | 53.19,54.25 58.52,48.92 58.98,48.92 U$1.3 | 37.19,64.92 34.75,62.48 34.75,60.2 30.94,56.39 30.94,51.82 32.31,50.44 32.31,49.99 U1.3 | v45.72,46.63 53.19,54.1 53.19,54.25 | 37.19,64.92 v36.42,65.68 | 1.37,55.63 7.01,55.63 9.75,58.37 16.61,58.37 v17.22,58.98 | v18.14,58.06 18.14,60.05 20.42,62.33 | v75.74,65.84 75.74,61.42 | 75.74,61.42 MCU2.GND_1
  Bottom 0.152: v5.03,72.85 5.03,73.91 JP11.2 | v48.77,28.19 v47.85,29.11 | v75.89,69.95 v76.81,70.87 | v45.72,46.63 v46.63,45.72 | v36.42,65.68 v35.2,66.9 | v18.14,58.06 v17.22,58.98 | v76.66,66.75 v75.74,65.84
  pour Bottom (isolate 0.305): 0,80 100,80 100,0 0,0
GPS_RX  (via drill 0.35)
  Top 0.152: TP10.TP 34.29,5.94 37.03,8.69 37.03,15.85 37.34,16.15 37.95,16.15 38.25,15.85 46.48,15.85 48.46,13.87 48.46,13.26 MCU2.TX3 48.62,13.11 49.23,12.5 v49.23,11.12 | v97.99,34.14 98.75,34.9 98.75,45.11 98.15,45.72 97.38,45.72 96.47,46.63 96.47,47.55 97.54,48.62 97.54,49.53 U3.4 | v97.08,33.22 97.08,32.77 97.54,32.31 97.54,23.16 89.31,14.94 74.83,14.94 73.15,13.26 73.15,8.84 v73.46,8.53 | v70.1,8.84 70.1,8.38 69.65,7.92 69.65,7.16 68.89,6.4 68.12,6.4 67.97,6.55 66.45,6.55 65.38,5.49 v62.33,5.49 | v61.42,4.57 55.78,4.57 v55.63,4.72 | v54.25,6.1 54.25,7.01 54.41,7.16 54.41,8.23 52.88,9.75 48.77,9.75 v48.31,10.21
  Bottom 0.152: v97.08,33.22 v97.99,34.14 | v73.46,8.53 71.78,8.53 71.48,8.84 v70.1,8.84 | v61.42,4.57 v62.33,5.49 | v54.25,6.1 v55.63,4.72 | v49.23,11.12 v48.31,10.21
GPS_TX
  Top 0.152: 34.75,2.74 34.29,2.29 TP11.TP 34.75,2.74 | 34.75,2.74 35.81,3.81 35.81,6.86 37.34,8.38 37.34,14.33 38.25,15.24 43.59,15.24 45.57,13.26 45.87,13.26 MCU2.RX3 | 34.75,2.74 26.67,10.82 20.27,10.82 12.04,19.05 12.04,42.06 17.53,47.55 17.53,58.37 17.83,58.67 17.83,62.79 16.61,64.01 16.61,67.36 17.53,68.28 17.53,73.15 22.86,78.49 39.17,78.49 44.04,73.61 80.62,73.61 81.53,72.69 81.53,72.39 81.84,72.08 81.84,69.49 85.19,66.14 87.94,66.14 88.54,66.75 88.54,71.93 92.35,75.74 93.57,75.74 94.64,74.68 94.64,70.87 98.75,66.75 98.75,49.07 97.69,48.01 97.69,47.09 U3.5
I1
  Top 0.152: MCU2.27 20.73,20.88 20.73,21.95 21.64,22.86 21.64,36.88 21.49,37.03 21.49,37.95 21.79,38.25 21.79,39.17 22.71,40.08 27.58,40.08 32.31,44.81 U1.5
I2
  Top 0.152: MCU2.28 23.01,23.32 23.01,24.54 21.95,25.6 21.95,36.27 23.16,37.49 27.58,37.49 32.31,42.22 U1.6
INT1  (via drill 0.35)
  Top 0.152: v22.1,19.05 22.55,19.05 23.16,19.66 23.47,19.66 24.84,21.03 24.84,25.76 v26.52,27.43 | v26.52,29.26 26.52,32.77 v28.35,34.59 | v29.26,35.51 31.24,37.49 31.24,37.64 32,38.41 36.42,38.41 40.54,42.52 47.7,42.52 48.01,42.82 48.01,43.43 v47.4,44.04 | v48.31,44.96 52.27,44.96 v52.88,44.35 | v54.25,44.81 57.61,44.81 58.98,46.18 U$1.4
  Bottom 0.152: v22.1,19.05 22.1,18.29 20.73,16.92 20.73,15.7 MCU2.23 | v26.52,29.26 v26.52,27.43 | v29.26,35.51 v28.35,34.59 | v48.31,44.96 v47.4,44.04 | v52.88,44.35 53.8,44.35 v54.25,44.81
LED  (via drill 0.35)
  Top 0.152: v34.59,30.02 34.59,29.72 33.53,28.65 25.3,28.65 23.16,30.79 MCU2.34 | v35.51,29.11 36.58,29.11 36.88,29.41 41.45,29.41 43.28,27.58 v48.01,27.58 | v49.53,27.13 54.41,27.13 54.86,27.58 55.47,27.58 v56.08,26.98 | v58.22,27.13 58.22,27.43 61.27,30.48 61.57,30.48 62.33,31.24 63.55,31.24 64.31,30.48 v64.31,30.18 | v68.89,31.39 v65.53,31.39 | v70.1,30.18 70.1,25.3 71.02,24.38 J1.10
  Bottom 0.152: v35.51,29.11 v34.59,30.02 | v48.01,27.58 49.07,27.58 v49.53,27.13 | v56.08,26.98 58.06,26.98 v58.22,27.13 | v65.53,31.39 v64.31,30.18 | v70.1,30.18 v68.89,31.39
MISO  (via drill 0.35)
  Top 0.152: v61.57,34.14 58.52,31.09 58.52,30.18 57.91,29.57 | 57.91,29.57 57.3,28.96 57.3,25.3 58.22,24.38 J1.5 58.22,24.23 58.22,23.01 v56.84,21.64 | v55.63,31.85 54.1,33.38 53.65,33.38 MCU2.MISO_ICSP | v56.84,32.92 56.84,31.24 57.3,30.79 57.3,30.18 57.91,29.57 | v74.37,33.53 81.99,33.53 84.73,30.79 85.5,30.79 U$2.5 | v72.69,35.2 70.1,35.2 69.19,34.29 65.23,34.29 v64.31,35.2 | v37.64,15.54 45.87,15.54 v46.18,15.24 47.09,14.33 47.09,12.34 49.38,10.06 55.02,10.06 57.3,7.77 58.22,7.77 U2.5 | v36.42,15.54 35.66,15.54 35.05,16.15 34.44,16.15 33.22,14.94 28.96,14.94 26.67,12.65 26.67,12.04 25.76,11.12 20.88,11.12 v20.57,11.43 | v19.66,10.52 19.66,10.21 24.08,5.79 24.54,5.79 TP6.TP | v48.77,17.83 v54.71,17.83
  Bottom 0.152: v61.57,34.14 63.25,35.81 JP1.2 63.4,35.81 64.01,35.2 v64.31,35.2 | v55.63,31.85 56.69,32.92 v56.84,32.92 | v72.69,35.2 v74.37,33.53 | v36.42,15.54 v37.64,15.54 | v19.66,10.52 v20.57,11.43 | v56.84,21.64 56.84,21.18 57,21.03 57,20.12 v54.71,17.83 | v46.18,15.24 v48.77,17.83
MISO+  (via drill 0.35)
  Top 0.152: v80.77,63.25 80.47,62.94 80.47,60.35 81.23,59.59 81.53,59.59 89.46,51.66 89.46,51.36 IC2.6 | v81.84,64.31 80.16,64.31 78.79,65.68 v78.79,65.99 | v76.05,68.73 74.22,68.73 73.91,69.04 69.8,69.04 68.89,69.95 X2.5
  Bottom 0.152: v81.84,64.31 v80.77,63.25 | v76.05,68.73 v78.79,65.99
MISO+R  (via drill 0.35)
  Top 0.152: v71.17,56.54 71.17,50.44 72.39,49.23 75.74,49.23 77.57,51.05 IC3.6 | v68.12,60.66 68.12,61.87 63.86,66.14 v54.41,66.14 | v51.97,69.34 51.36,69.34 50.75,69.95 X4.5
  Bottom 0.152: v71.17,56.54 71.17,57.61 v68.12,60.66 | v54.41,66.14 53.03,67.51 53.03,68.28 v51.97,69.34
MISO-  (via drill 0.35)
  Top 0.152: v91.29,48.46 91.9,49.07 91.9,51.21 IC2.5 | v90.07,49.53 89.31,49.53 87.94,50.9 87.94,52.73 83.36,57.3 v82.91,57.3 | v81.69,56.08 81.23,56.54 79.1,56.54 v78.79,56.24 | v76.5,58.06 75.13,58.06 72.85,60.35 v72.85,63.55 | v71.93,64.47 71.93,65.68 70.26,67.36 X2.4
  Bottom 0.152: v91.29,48.46 90.22,49.53 v90.07,49.53 | v81.69,56.08 v82.91,57.3 | v78.79,56.24 78.33,56.24 v76.5,58.06 | v71.93,64.47 v72.85,63.55
MISO-R  (via drill 0.35)
  Top 0.152: v77.88,48.16 80.01,50.29 80.01,51.05 IC3.5 | v76.96,49.07 76.05,49.07 75.89,48.92 71.63,48.92 v66.29,54.25 | v63.55,58.06 59.89,58.06 57.3,60.66 57.3,62.48 54.56,65.23 v53.19,65.23 | v52.27,66.14 52.27,67.21 52.12,67.36 X4.4
  Bottom 0.152: v76.96,49.07 v77.88,48.16 | v66.29,54.25 66.29,55.17 65.53,55.93 65.53,56.08 v63.55,58.06 | v52.27,66.14 v53.19,65.23
MISO_5V  (via drill 0.35)
  Top 0.152: v62.94,44.96 62.94,46.18 S3.5 | v60.35,35.36 v60.35,37.64 | v61.57,33.22 61.57,32.77 57.61,28.8 57.61,26.82 58.98,25.45 v59.44,25.45 | v59.44,21.64 58.37,20.57 U2.15
  Bottom 0.152: v62.94,44.96 63.86,44.04 63.86,43.13 60.35,39.62 v60.35,37.64 | v60.35,35.36 60.35,34.44 v61.57,33.22 | v59.44,25.45 59.44,24.99 59.59,24.84 59.59,21.79 v59.44,21.64
MOSI  (via drill 0.35)
  Top 0.152: v62.48,30.02 62.48,26.98 60.96,25.45 60.96,24.38 J1.6 | v50.44,32.16 49.99,32.61 49.99,33.98 51.05,35.05 51.05,35.97 MCU2.MOSI_ICSP | v51.66,30.94 53.34,30.94 55.32,28.96 55.93,28.96 56.24,29.26 56.24,30.02 v55.78,30.48 | v58.22,28.5 58.67,28.5 v61.27,31.09 | v69.8,21.49 69.8,19.66 72.54,16.92 72.54,7.47 71.48,6.4 69.65,6.4 68.58,5.33 66.14,5.33 64.47,3.66 63.25,3.66 60.96,5.94 58.37,5.94 56.69,7.62 55.93,7.62 U2.4 55.78,7.62 55.78,6.71 53.19,4.12 49.99,4.12 46.79,7.32 41.91,7.32 40.84,8.38 v39.93,8.38 | U$2.6 82.91,30.63 82.91,30.18 81.99,29.26 78.18,29.26 77.72,28.8 76.96,28.8 76.5,29.26 71.02,29.26 70.41,28.65 70.41,27.74 72.24,25.91 72.24,23.77 71.48,23.01 v70.26,23.01 69.95,22.71 62.94,22.71 62.64,22.4 v62.18,22.4 | v27.74,8.84 24.69,8.84 TP5.TP | v28.65,9.75 31.09,9.75 32.16,8.69 36.12,8.69 v36.42,8.99
  Bottom 0.152: JP9.1 63.4,29.26 62.64,30.02 v62.48,30.02 62.33,30.02 v61.27,31.09 | v51.66,30.94 v50.44,32.16 | v55.78,30.48 56.24,30.48 v58.22,28.5 | v69.8,21.49 69.8,22.55 v70.26,23.01 | v28.65,9.75 v27.74,8.84 | v36.42,8.99 37.34,8.99 37.95,8.38 v39.93,8.38 | v62.18,22.4 60.96,23.62 60.96,24.23 J1.6
MOSI+
  Top 0.152: R7.2 91.9,54.86 90.98,53.95 90.98,49.07 90.53,48.62 87.02,48.62 84.43,51.21 IC2.8 84.28,51.36 83.67,51.36 81.53,53.49 80.31,53.49 79.86,53.03 79.25,53.03 78.94,53.34 78.94,53.65 77.88,54.71 75.44,54.71 70.1,60.05 70.1,61.27 65.08,66.29 65.08,67.36 X2.8
MOSI+R  (via drill 0.35)
  Top 0.152: X4.8 46.94,67.51 47.85,68.43 60.5,68.43 61.42,67.51 62.94,67.51 68.73,61.72 68.73,60.35 71.78,57.3 71.78,56.24 71.48,55.93 71.48,54.56 72.39,53.65 72.39,51.21 IC3.8 72.54,51.05 74.07,49.53 75.44,49.53 76.05,50.14 76.05,51.51 77.57,53.03 v77.57,54.1 | v78.79,55.32 79.1,55.02 80.01,55.02 R8.2
  Bottom 0.152: v77.57,54.1 v78.79,55.32
MOSI-
  Top 0.152: IC2.7 86.87,51.36 84.43,53.8 84.43,54.86 R7.1 84.28,55.02 80.16,59.13 80.16,62.48 79.4,63.25 79.25,63.25 73.76,68.73 68.73,68.73 67.51,69.95 66.45,69.95 X2.7
MOSI-R
  Top 0.152: IC3.7 74.98,51.21 74.98,52.43 72.54,54.86 R8.1 72.39,55.02 72.39,57.15 69.8,59.74 69.8,61.11 63.09,67.82 61.72,67.82 60.81,68.73 50.6,68.73 49.38,69.95 48.31,69.95 X4.7
MOSI_5V  (via drill 0.35)
  Top 0.152: v68.28,43.28 67.97,42.98 65.68,42.98 65.23,43.43 65.23,44.04 65.99,44.81 65.99,46.18 S3.2 | v69.19,42.37 61.87,42.37 v61.72,42.22 | v57.3,38.56 57.3,37.49 v56.84,37.03 | v55.63,35.81 55.63,32.77 56.24,32.16 56.24,30.94 56.54,30.63 56.54,28.35 v56.39,28.19 | v55.17,26.98 55.17,25.45 54.56,24.84 v54.56,23.01 | v54.56,21.79 55.78,20.57 U2.14
  Bottom 0.152: v69.19,42.37 v68.28,43.28 | v61.72,42.22 59.44,39.93 58.67,39.93 v57.3,38.56 | v55.63,35.81 v56.84,37.03 | v55.17,26.98 v56.39,28.19 | v54.56,21.79 v54.56,23.01
N$1
  Top 0.152: C2.1 80.47,65.68 91.59,65.68 92.81,66.9 U$3.3 92.96,67.06 92.96,74.07 U$3.2
N$2
  Top 0.152: S3.6 62.94,43.89 63.86,44.81 63.86,46.48 65.99,48.62 S3.1 66.14,48.62 66.9,47.85 73.3,47.85 74.98,46.18 | 74.98,46.18 75.13,46.02 75.13,43.59 IC3.2 | 74.98,46.18 76.05,47.24 82.3,47.24 83.52,46.02 83.97,46.02 86.26,43.74 86.87,43.74 IC2.2
N$3  (via drill 0.35)
  Top 0.152: v64.01,47.55 62.94,48.62 S3.4 | v64.92,46.63 64.92,43.28 65.53,42.67 68.58,42.67 68.89,42.98 68.89,43.59 68.58,43.89 | 68.58,43.89 66.14,43.89 S3.3 | 78.03,43.89 79.55,45.41 v82.75,45.41 | 78.03,43.89 77.72,43.59 IC3.3 78.03,43.89 | v83.97,46.63 86.56,46.63 89.46,43.74 IC2.3 | 68.58,43.89 69.34,44.65 v69.34,44.81 | v74.52,45.72 v70.26,45.72 | v76.05,45.72 77.88,43.89 78.03,43.89
  Bottom 0.152: v64.92,46.63 v64.01,47.55 | v83.97,46.63 v82.75,45.41 | v70.26,45.72 v69.34,44.81 | v76.05,45.72 v74.52,45.72
N$4
  Top 0.152: MCU2.TX2 43.59,13.11 43.89,13.11 47.55,9.45 51.51,9.45 53.19,7.77 U2.3
N$5
  Top 0.152: MCU2.RX2 41,13.11 41.3,13.11 45.26,9.14 49.23,9.14 50.6,7.77 U2.2
N$6  (via drill 0.35)
  Top 0.152: v3.35,55.02 3.35,26.98 6.4,23.93 6.4,22.55 X1.21 | v2.13,56.24 2.13,56.69 1.98,56.84 1.98,59.44 3.5,60.96 5.94,60.96 10.97,65.99 11.12,65.99 14.33,69.19 14.48,69.19 16.92,71.63 16.92,73.46 19.96,76.5 19.96,77.42 v20.57,78.03 | v23.16,77.88 39.32,77.88 44.04,73.15 80.62,73.15 81.23,72.54 v81.23,71.78 | v82.45,73 81.84,73.61 81.69,73.61 81.38,73.91 81.38,74.52 81.69,74.83 86.56,74.83 S1.3
  Bottom 0.152: v2.13,56.24 v3.35,55.02 | v20.57,78.03 21.18,78.64 22.4,78.64 v23.16,77.88 | v82.45,73 v81.23,71.78
N$7
  Top 0.152: 80.47,76.05 80.47,74.22 81.84,72.85 81.84,72.54 86.56,67.82 86.56,67.36 S1.1 | 80.47,76.05 80.47,78.03 R4.2 | 80.47,76.05 93.73,76.05 97.23,72.54 97.23,70.56 U$3.1
N$8
  Top 0.152: JP7.1 37.19,52.27 32.61,52.27 32.46,52.43 U1.2
N$9
  Top 0.152: JP6.1 63.86,55.47 60.66,55.47 59.13,53.95 U$1.1
N$10  (via drill 0.35)
  Top 0.152: v87.63,27.89 87.33,28.19 83.67,28.19 81.99,26.52 73.91,26.52 72.24,28.19 JP2.1 | v89.15,29.41 89.92,29.41 90.07,29.26 93.42,29.26 94.79,30.63 95.71,30.63 U$2.1
  Bottom 0.152: v89.15,29.41 v87.63,27.89
N$11  (via drill 0.35)
  Top 0.152: v18.14,75.59 v5.79,75.59 | v19.51,74.22 19.81,74.22 20.88,75.29 24.54,75.29 25.6,74.22 25.6,73.3 24.54,72.24 v24.38,72.24
  Bottom 0.152: 5.49,75.89 5.79,76.2 5.79,76.81 JP12.1 | 5.49,75.89 4.27,74.68 4.27,74.07 JP11.3 | v5.79,75.59 5.49,75.89 | v19.51,74.22 v18.14,75.59 | v24.38,72.24 25.6,71.02 J8.3
N$12
  Top 0.152: MCU2.22 23.16,15.7 25.15,15.7 26.06,16.61 33.53,16.61 35.2,18.29 39.17,18.29 41.3,16.15 47.7,16.15 53.49,10.36 60.81,10.36 63.4,7.77 U2.7
N$13
  Top 0.152: JP3.1 44.5,24.23 46.18,24.23 47.7,22.71 49.07,22.71 50.6,24.23 J1.2
N$14  (via drill 0.35)
  Top 0.152: v94.34,57.45 97.23,60.35 97.23,61.57 JP4.1 | v95.25,56.54 95.71,56.54 97.54,54.71 U3.2
  Bottom 0.152: v95.25,56.54 v94.34,57.45
N$15  (via drill 0.35)
  Top 0.152: v3.35,71.93 4.42,73 4.42,73.15 4.72,73.46 5.33,73.46 5.64,73.15 5.64,70.41 v9.6,66.45 | v10.97,65.08 11.89,65.08 13.11,66.29 15.39,66.29 16,66.9 v16,68.12 | v17.22,67.06 17.22,67.51 20.12,70.41 20.12,70.87 J8.5
  Bottom 0.152: v3.35,71.93 4.27,71.02 JP10.3 | v10.97,65.08 v9.6,66.45 | v16,68.12 17.07,67.06 v17.22,67.06
N$16  (via drill 0.35)
  Top 0.152: v3.35,77.72 3.96,77.72 4.88,78.64 20.88,78.64 v21.49,78.03 | v22.4,77.11 28.19,77.11 31.09,74.22 31.09,73.3 30.33,72.54 28.19,72.54 27.13,73.61 J8.7
  Bottom 0.152: v3.35,77.72 4.12,76.96 JP12.3 | v22.4,77.11 v21.49,78.03
N$17  (via drill 0.35)
  Top 0.152: v17.22,62.48 14.48,59.74 IC1.8 | v19.2,64.47 19.2,66.45 21.03,68.28 23.01,68.28 24.54,66.75 24.54,64.77 25.76,63.55 26.67,63.55 27.28,64.16 27.28,65.08 26.36,65.99 25.76,65.99 25.15,66.6 25.15,67.67 25.76,68.28 29.26,68.28 31.39,66.14 R2.1
  Bottom 0.152: v19.2,64.47 v17.22,62.48
N$18  (via drill 0.35)
  Top 0.152: v6.55,72.85 9.75,72.85 12.04,75.13 15.7,75.13 v16.46,74.37 | v18.14,72.69 20.73,72.69 21.64,71.78 21.64,70.41 22.4,69.65 27.13,69.65 28.35,70.87 J8.2
  Bottom 0.152: 5.94,72.85 5.94,71.02 JP10.1 | 5.94,72.85 5.94,73.91 JP11.1 | v6.55,72.85 5.94,72.85 | v18.14,72.69 v16.46,74.37
N$19  (via drill 0.35)
  Top 0.152: v61.87,39.17 61.11,39.17 59.13,41.15 U$1.6
  Bottom 0.152: v61.87,39.17 62.64,39.93 63.25,39.93 JP5.1
N$20  (via drill 0.35)
  Top 0.152: v62.03,36.58 60.96,37.64 60.96,37.95 60.35,38.56 59.13,38.56 U$1.7
  Bottom 0.152: v62.03,36.58 62.18,36.73 63.25,36.73 JP1.1
N$21
  Bottom 0.152: JP9.2 62.87,27.94 57.78,33.02 57.78,35.56 59.05,35.56 U$1.8
N$22
  Bottom 0.152: JP8.2 62.87,32.38 60.33,32.38 59.69,33.02 U$1.9
NPD
  Top 0.152: MCU2.33 20.57,28.5 20.57,29.57 19.2,30.94 19.2,31.85 18.9,32.16 18.9,38.25 20.73,40.08 21.03,40.08 22.1,41.15 22.1,41.45 23.16,42.52 28.5,42.52 32,46.02 33.53,46.02 34.29,45.26 37.03,45.26 37.34,44.96 44.96,44.96 46.33,46.33 51.82,46.33 53.95,44.2 57.91,44.2 58.67,44.96 59.59,44.96 60.5,44.04 60.5,41.91 63.4,39.01 63.4,33.68 64.16,32.92 64.16,31.7 65.84,30.02 65.84,29.26 68.43,26.67 68.43,24.38 J1.9
PPS
  Top 0.152: MCU2.29 20.57,23.32 20.57,24.38 18.9,26.06 18.9,31.7 18.59,32 18.59,39.17 16.31,41.45 16.31,45.87 20.57,50.14 21.03,50.14 22.1,51.21 22.1,51.66 23.16,52.73 26.36,52.73 32.31,58.67 32.31,63.09 38.71,69.49 45.41,69.49 47.55,71.63 75.13,71.63 77.27,69.49 77.27,65.68 79.1,63.86 81.38,63.86 83.06,62.18 83.06,60.2 86.41,56.84 94.64,56.84 94.94,57.15 97.54,57.15 U3.1
RPI_RX  (via drill 0.35)
  Top 0.152: 38.25,10.36 38.25,13.11 MCU2.TX1 | 38.25,10.36 37.64,9.75 37.64,9.14 41.3,5.49 41.3,3.66 42.52,2.44 42.98,2.44 TP15.TP | v64.16,1.98 64.92,1.22 66.6,1.22 67.82,2.44 68.58,2.44 J2.2 | v62.03,2.13 56.84,2.13 v54.86,4.12 | v53.49,5.49 51.21,5.49 49.38,7.32 49.38,8.08 48.62,8.84 42.52,8.84 42.22,8.53 41.6,8.53 39.78,10.36 38.25,10.36
  Bottom 0.152: v64.16,1.98 62.18,1.98 v62.03,2.13 | v53.49,5.49 v54.86,4.12
RPI_TX  (via drill 0.35)
  Top 0.152: v36.42,11.12 35.97,11.58 35.97,13.11 MCU2.RX1 | v38.25,9.45 38.25,8.99 41.45,5.79 42.98,5.79 TP14.TP 43.13,5.64 43.43,5.64 45.72,3.35 v46.33,3.35 | v68.58,3.96 68.89,3.96 70.26,2.59 71.17,2.59 J2.1 | v67.51,4.72 65.99,4.72 62.48,1.22 48.46,1.22 v47.24,2.44
  Bottom 0.152: v36.42,11.12 38.1,9.45 v38.25,9.45 | v68.58,3.96 68.28,3.96 v67.51,4.72 | v46.33,3.35 v47.24,2.44
RST
  Top 0.152: MCU2.RESET_ICSP 53.65,38.41 54.56,38.41 58.22,34.75 61.87,34.75 63.86,32.77 63.86,31.55 65.53,29.87 65.53,29.11 65.84,28.8 65.84,24.38 J1.8
SCK  (via drill 0.35)
  Top 0.152: v62.18,25.76 63.25,26.82 v63.25,30.63 62.18,30.63 61.87,30.33 61.87,26.98 60.81,25.91 60.2,25.91 | v55.63,29.57 55.47,29.57 52.43,32.61 52.43,34.29 53.49,35.36 53.49,35.97 MCU2.SCK_ICSP | v59.13,27.13 59.89,26.36 59.89,26.21 60.2,25.91 | 62.33,7.01 62.94,6.4 63.86,6.4 64.62,7.16 64.62,8.08 62.48,10.21 v62.48,19.2 | 62.33,7.01 61.72,7.62 60.96,7.62 U2.6 | v60.2,22.86 60.2,23.32 59.59,23.93 59.59,24.69 60.2,25.3 60.2,25.91 | v72.69,32.31 72.69,32.77 74.07,34.14 83.82,34.14 87.17,30.79 88.09,30.79 U$2.4 | v71.32,33.68 65.84,33.68 v64.77,32.61 | v28.65,7.92 28.04,7.32 28.04,5.49 24.99,2.44 24.69,2.44 TP7.TP | v29.57,8.84 30.18,9.45 30.94,9.45 32.61,7.77 v35.2,7.77 | v36.42,6.55 36.42,5.94 38.41,3.96 40.08,3.96 v41,3.05 | v41.91,3.96 44.65,3.96 45.87,2.74 46.63,2.74 47.7,3.81 53.65,3.81 55.17,5.33 v60.66,5.33 | 62.33,7.01 v61.57,6.25
  Bottom 0.152: v63.25,30.63 63.25,31.39 JP8.1 63.4,31.55 63.7,31.55 v64.77,32.61 | v62.18,25.76 63.55,24.38 J1.7 | v55.63,29.57 56.24,29.57 58.06,27.74 58.52,27.74 v59.13,27.13 | v62.48,19.2 62.48,19.81 62.03,20.27 62.03,21.03 v60.2,22.86 | v71.32,33.68 v72.69,32.31 | v29.57,8.84 v28.65,7.92 | v36.42,6.55 v35.2,7.77 | v41.91,3.96 v41,3.05 | v61.57,6.25 v60.66,5.33
SCK_5V  (via drill 0.35)
  Top 0.152: X2.3 71.32,70.1 70.41,71.02 63.4,71.02 61.42,69.04 55.32,69.04 54.41,69.95 53.34,69.95 X4.3 53.19,70.1 52.27,71.02 47.85,71.02 45.41,68.58 45.41,66.14 45.72,65.84 48.92,65.84 52.12,62.64 52.12,60.66 55.32,57.45 64.16,57.45 65.53,56.08 65.53,54.1 71.17,48.46 77.27,48.46 78.49,49.68 78.49,51.51 79.7,52.73 80.01,52.73 80.47,53.19 81.38,53.19 81.69,52.88 81.69,51.51 85.34,47.85 v85.34,47.4 | v86.26,48.31 87.33,48.31 90.68,44.96 90.68,41.15 91.75,40.08 91.75,37.19 96.93,32 96.93,30.33 95.71,29.11 94.49,29.11 87.63,22.25 78.79,22.25 78.64,22.4 63.09,22.4 61.27,20.57 60.96,20.57 U2.16
  Bottom 0.152: v85.34,47.4 v86.26,48.31
SCL1  (via drill 0.35)
  Top 0.152: MCU2.SCL1 97.99,13.11 97.99,11.73 91.75,5.49 91.75,3.96 R6.2 91.59,3.81 85.19,3.81 84.28,2.9 80.31,2.9 v73.76,9.45 | v32.77,31.09 32.46,31.39 32.46,37.19 U1.8 | v29.57,27.43 29.57,23.93 25.3,19.66 25.3,19.05 26.21,18.14 v26.67,18.14 | v26.67,16 26.67,15.39 26.06,14.78 | 26.06,14.78 24.99,13.72 v24.99,12.04 | v22.86,9.91 22.86,8.53 24.08,7.32 25.3,7.32 v27.13,5.49 | v28.04,4.57 28.04,3.96 29.57,2.44 TP9.TP | v71.93,9.45 67.82,9.45 64.92,12.34 64.92,14.17 v63.4,15.7 | v61.87,16 49.23,16 48.16,17.07 42.22,17.07 v41.6,17.68 | v40.08,16.46 34.29,16.46 33.07,15.24 28.35,15.24 27.28,14.17 26.67,14.17 26.06,14.78
  Bottom 0.152: v32.77,31.09 32.77,30.63 31.55,29.41 31.55,29.26 30.63,28.35 30.48,28.35 v29.57,27.43 | v26.67,16 v26.67,18.14 | v22.86,9.91 v24.99,12.04 | v28.04,4.57 v27.13,5.49 | v71.93,9.45 v73.76,9.45 | v61.87,16 62.18,15.7 v63.4,15.7 63.5,15.88 64.14,16.51 67.31,16.51 67.31,31.11 64.14,34.29 63.5,34.29 62.87,33.66 JP8.3 | v41.6,17.68 41.3,17.68 v40.08,16.46
SDA1  (via drill 0.35)
  Top 0.152: 91.75,9.45 91.75,7.16 R5.2 | 91.75,9.45 95.4,13.11 MCU2.SDA1 | v35.97,39.01 35.36,39.62 32.46,39.62 U1.7 | v37.19,30.33 v37.19,37.8 | v37.19,28.8 37.19,26.21 38.25,25.15 38.56,25.15 38.86,24.84 38.86,24.23 37.8,23.16 | v32.77,18.14 37.8,23.16 | v34.75,15.54 34.75,10.97 v33.98,10.21 | 91.75,9.45 74.68,9.45 v73.76,10.36 | v71.93,10.36 69.49,10.36 67.36,12.5 67.36,14.33 65.99,15.7 v64.31,15.7 | v61.87,15.09 49.68,15.09 48.01,16.76 41.6,16.76 40.69,17.68 v40.69,18.14 | v41.15,19.96 37.95,23.16 37.8,23.16
  Bottom 0.152: v37.19,37.8 v35.97,39.01 | v37.19,30.33 v37.19,28.8 37.47,28.57 40.01,26.04 59.05,26.04 60.33,27.3 62.87,27.3 JP9.3 | v32.77,18.14 32.77,17.53 v34.75,15.54 | v33.98,10.21 29.57,5.79 TP8.TP | v71.93,10.36 v73.76,10.36 | v64.31,15.7 63.7,15.09 v61.87,15.09 | v40.69,18.14 40.69,19.51 v41.15,19.96
VIN  (via drill 0.35)
  Top 0.152: v60.66,67.36 54.56,67.36 X4.2 54.41,67.36 52.43,65.38 v50.29,65.38 | v61.87,68.58 68.43,68.58 68.58,68.43 71.63,68.43 72.54,67.51 X2.2 72.54,67.36 72.54,64.16 71.48,63.09 71.48,61.42 MCU2.VIN | v15.24,12.04 14.02,10.82 14.02,5.79 TP1.TP | v16.31,13.11 16.31,13.87 11.43,18.75 11.43,46.94 v16.61,52.12 | v18.14,53.65 19.05,53.65 20.73,55.32 27.13,55.32 v30.02,58.22 | v33.07,57.61 41.6,57.61 43.59,59.59 44.5,59.59 v45.41,60.5 | v49.38,64.47 v46.63,61.72
  Bottom 0.152: v61.87,68.58 v60.66,67.36 | v16.31,13.11 v15.24,12.04 | v18.14,53.65 v16.61,52.12 | v30.02,58.22 30.63,58.83 31.85,58.83 v33.07,57.61 | v46.63,61.72 v45.41,60.5 | v50.29,65.38 v49.38,64.47